# Altium schematic sheet amplifer_with_LT1638.SchDoc
size 286 x 253 mm
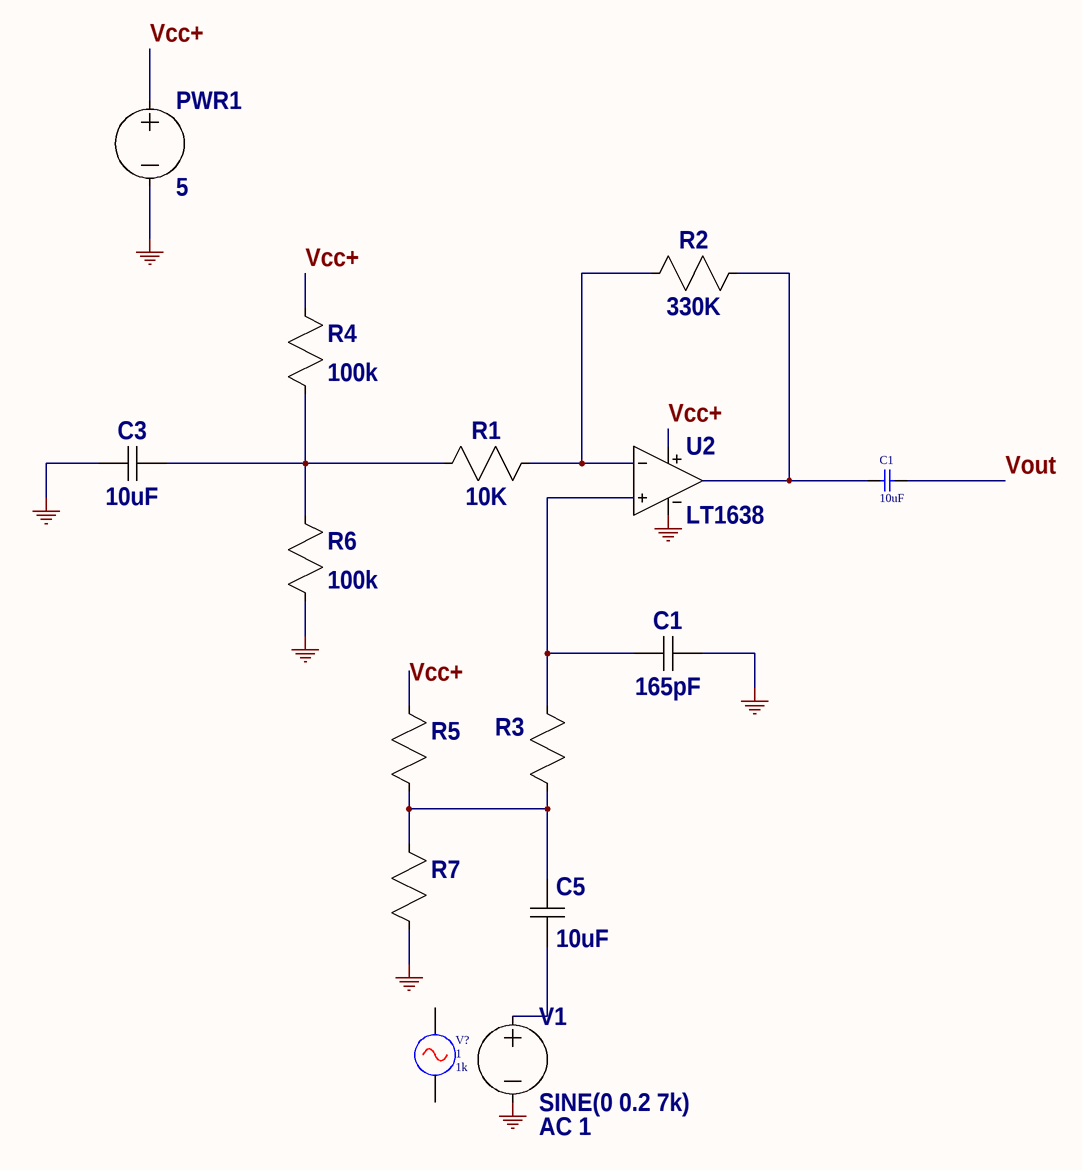
[diagram p0: amplifer_with_LT1638.SchDoc]

## Parts
(Parts that share a designator on the sheet are numbered #1, #2 ... from top to bottom, then left to right.)
C1#1  value 10uF  (hidden comment: Capacitor)
C1#2  165pF
C3  10uF
C5  10uF
PWR1  5
R1  10K
R2  330K
R3  10K  (value not drawn)
R4  100k
R5  100k  (value not drawn)
R6  100k
R7  100k  (value not drawn)
U2  LT1638
V1  SINE(0 0.2 7k)  Value2: AC 1
V?  Amp: 1  Freq: 1k  (hidden comment: AC Voltage Source)

## Nets
GND: C1#2.1(A) C3.2(B) PWR1.2(-) R6.2(B) R7.2(B) U2.4(V-) V1.2(-)
Vcc+: PWR1.1(+) R4.1(A) R5.1(A) U2.3(V+)
Vout: C1#1.2
NetC1#1_1: C1#1.1 R2.1(A) U2.5(OUT)
NetC1#2_2: C1#2.2(B) R3.2(B) U2.1(In+)
NetC3_1: C3.1(A) R1.2(B) R4.2(B) R6.1(A)
NetC5_1: C5.1(A) R3.1(A) R5.2(B) R7.1(A)
NetC5_2: C5.2(B) V1.1(+)
NetR1_1: R1.1(A) R2.2(B) U2.2(In-)

Not connected (* = marked no-connect by the designer): V? 1 2

## Library data of the parts
C1#1 = Capacitor: SimulationGenericComponent: True
C1#2 = Cap-165pF: InstName: C1; Prefix: C; Value: 165pF
C3 = Cap-10uF: InstName: C3; Prefix: C; Value: 10uF
C5 = Cap-10uF: InstName: C5; Prefix: C; Value: 10uF
PWR1 = Voltage-5: voltage source; InstName: PWR1; Prefix: V; Value: 5
R1 = Res-10K: InstName: R1; Prefix: R; Value: 10K
R2 = Res-330K: InstName: R2; Prefix: R; Value: 330K
R3 = Res-10K: InstName: R3; Prefix: R; Value: 10K
R4 = Res-100k: InstName: R4; Prefix: R; Value: 100k
R5 = Res-100k: InstName: R5; Prefix: R; Value: 100k
R6 = Res-100k: InstName: R6; Prefix: R; Value: 100k
R7 = Res-100k: InstName: R7; Prefix: R; Value: 100k
U2 = LT1638: InstName: U2; Prefix: X; Value: LT1638; SpiceModel: LTC.lib; Value2: LT1638
V1 = voltage: SINE voltage source; InstName: V1; Prefix: V; Value: SINE(0 0.2 7k)
V? = AC Voltage Source: SimulationGenericComponent: True; DC: 0; Phase: 0; Rser: 0; Cpar: 0